# Altium schematic sheet SCH_W-F-FC-HX2X.SchDoc: PCB_Project_WNDCVX1X_CONTROL_BOARD
size A4; DrawnBy: Raihan Bin Mofidul; Organization: Walton Hi-Tech Industries Ltd.; DocumentNumber: 1; Revision: 1.2; SheetNumber: 1
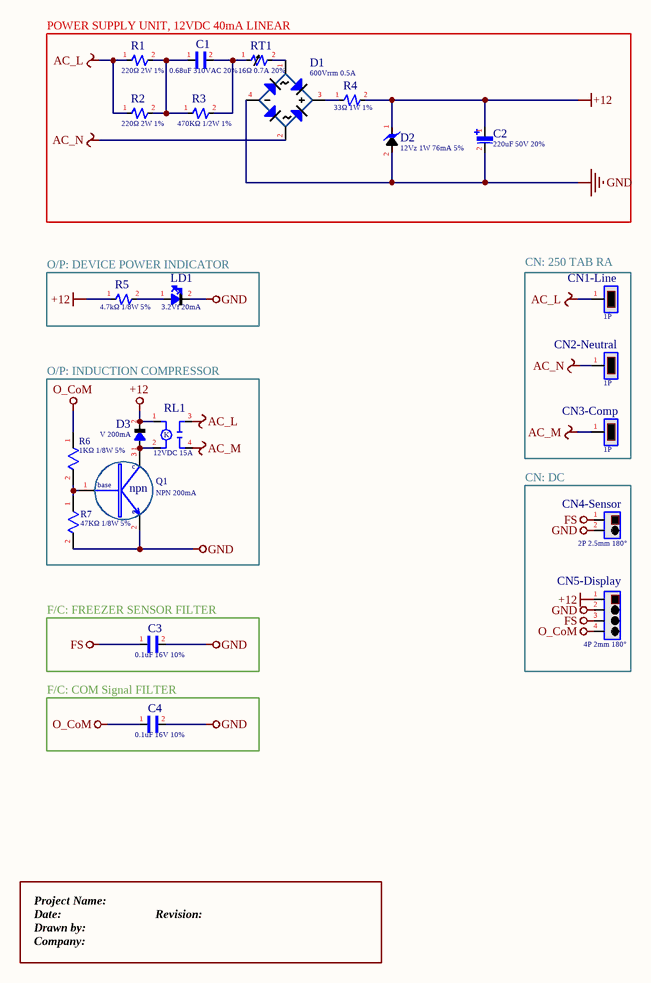
[diagram p0: SCH_W-F-FC-HX2X.SchDoc]

## Parts
C1  0.68uF 310VAC 20%  [C_X2_18X10X15.8_P15]
C2  220uF 50V 20%  [C_Radial_Ø8*11mm_P3.5]
C3  0.1uF 16V 10%  [C_0805]
C4  0.1uF 16V 10%  [C_0805]
CN1-Line  1P  [CN_Tab Terminal 250 series (Right Angle)]
CN2-Neutral  1P  [CN_Tab Terminal 250 series (Right Angle)]
CN3-Comp  1P  [CN_Tab Terminal 250 series (Right Angle)]
CN4-Sensor  2P 2.5mm 180°  [CN_B2B-XH-A_RED]
CN5-Display  4P 2mm 180°  [CN_4P_A2001WV-XP-180DEG]
D1  600Vrrm 0.5A  [D_SMD_MB6S]
D2  12Vz 1W 76mA 5%  [D_SMD_LL-41]
D3  V 200mA  [D_SOT-23-3_200mA]
LD1  3.2Vf 20mA  [LED_3x5_P2.5]
Q1  NPN 200mA  [Q_SOT-23-3_NPN_BC847]
R1  220Ω 2W 1%  [R_Axial_P15]
R2  220Ω 2W 1%  [R_Axial_P15]
R3  470KΩ 1/2W 1%  [R_Axial_P10]
R4  33Ω 1W 1%  [R_Axial_P15]
R5  4.7kΩ 1/8W 5%  [R_0805]
R6  1KΩ 1/8W 5%  [R_0805]
R7  47KΩ 1/8W 5%  [R_0805]
RL1  12VDC 15A  [RL_SPST_15ARelay_AZ943-1AH-12DE]
RT1  16Ω 0.7A 20%  [NTC_5mmPitch]

## Blocks framed on the sheet
POWER SUPPLY UNIT, 12VDC 40mA LINEAR: C1 C2 D1 D2 R1-R4 RT1
O/P: DEVICE POWER INDICATOR: LD1 R5
CN: 250 TAB RA: CN1-Line CN2-Neutral CN3-Comp
O/P: INDUCTION COMPRESSOR: D3 Q1 R6 R7 RL1
CN: DC: CN4-Sensor CN5-Display
F/C: FREEZER SENSOR FILTER: C3
F/C: COM Signal FILTER: C4

## Nets
+12: C2.1 CN5-Display.1 D2.1(A) D3.2(K) R4.2 R5.1 RL1.1
AC_L: CN1-Line.1 R1.1 R2.1 RL1.3
AC_M: CN3-Comp.1 RL1.4
AC_N: CN2-Neutral.1 D1.2(AC)
FS: C3.1 CN4-Sensor.1 CN5-Display.3
GND: C2.2 C3.2 C4.2 CN4-Sensor.2 CN5-Display.2 D1.4(vss) D2.2(K) LD1.2(vss) Q1.2(Emitter) R7.2
O_CoM: C4.1 CN5-Display.4 R6.1
NetC1_1: C1.1 R1.2 R2.2 R3.1
NetC1_2: C1.2 R3.2 RT1.1
NetD1_1: D1.1(AC) RT1.2
NetD1_3: D1.3(VCC) R4.1
NetD3_1: D3.1(A) Q1.3(Collector) RL1.2
NetLD1_1: LD1.1(vdd) R5.2
NetQ1_1: Q1.1(Base) R6.2 R7.1

## Notes on the sheet
- Project Name:
- Date:
- Company:
- Drawn by:
- Revision:
- Title
- Size:
- A4
- Number:
- Time:
- Sheet
- of
- File:
- (in symbol BJT_npn) c; base; npn; e
- (in symbol Relay>> SPST) K

## Library data of the parts
C1 = Capacitor>> Non-Polar: 684K310V, P=15 18*9.5*15.5, Climate-category: 40/110/56
C2 = Capacitor>> Polar: Aluminum Electrolytic Capacitor, Through Hole, ØDxL=8*11mm Pitch=3.5mm
C3 C4 = Capacitor>> Non-Polar: Multilayer Ceramic Capacitors, SMD 0805
CN1-Line CN2-Neutral CN3-Comp = Connector>> 1Pin: 6.3mm PCB Tab Terminal (Right Angle)
CN4-Sensor = Connector>> 2Pins: A2512WV-XP, 2Pins, 2.5mmPitch, 180° Wafer, RED, Through Hole
CN5-Display = Connector>> 4Pins: A2001WV-XP, 4Pins, 2mmPitch, 180° Wafer, White, , Through Hole
D1 = Diode>> Bridge Rectifier: MB6S, SOIC, ON-SEMICONDUCTOR
D2 = Diode>> Zener: ZM4742, MELF SILICON PLANAR POWER ZENER DIODES, LL-41
D3 = Diode>> General Purpose: BAS19, SOT-23-3
LD1 = LED>> General Purpose: RED, Through hole, ØDxH=3x5mm Pitch=2.5mm
Q1 = BJT_npn: BC847, SOT-23-3
R1 R2 = Resistor>> General Purpose: Metal Oxide Film Resistor, Through Hole Axial, L=12, øD=5, H=28, ød=0.6, Flame Proof
R3 = Resistor>> General Purpose: Metal Oxide Film Resistor, Through Hole Axial, L=7, øD=2.5, H=28, ød=0.48, Flame Proof
R4 = Resistor>> General Purpose: Metal Oxide Film Resistor, Through Hole Axial, L=10, øD=4, H=28, ød=0.5, Flame Proof
R5 = Resistor>> General Purpose: Chip-Resistor, SMD 0805, , RoHS
R6 R7 = Resistor: Chip-Resistor, SMD 0805, , RoHS
RL1 = Relay>> SPST: Zettler AZ943–1CH–12DE; pin to pad: 1>2 2>1
RT1 = Thermistor>> NTC: 16D-7, NTC, Pitch 5mm